# EasyEDA Pro project hexcooler_v1.epro

# Schematic Schematic1
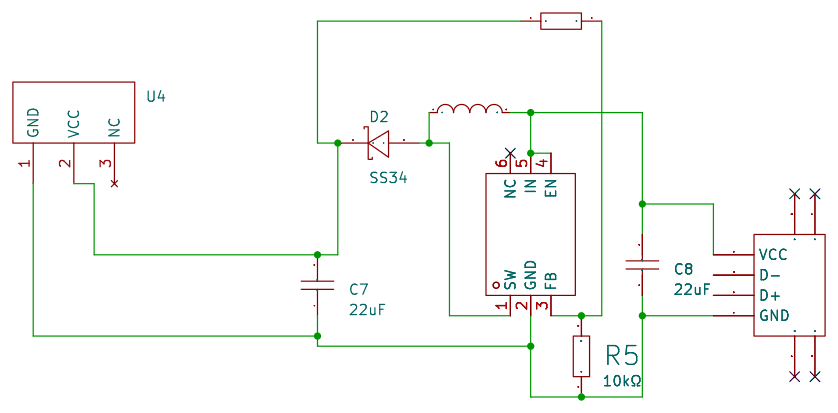
[diagram p0: schematic sheet]

## Parts
C7  22uF  [C1206]
C8  22uF  [C1206]
D2  SS34  [SMA_L4.3-W2.6-LS5.2-RD]
L1  4.7uH  [IND-SMD_L3.0-W3.0_LQH3NPN2R2NG0L]
R3  200kΩ  [R0805]
R5  10kΩ  [R0603]
U3  MT3608  [SOT-23-6_L2.9-W1.6-P0.95-LS2.8-BL]
U4  -  [pads junction]
USB6  911-321B2028S10100  [USB-A-SMD_911-321B2028S10100]

## Library data of the parts
C7 C8 = CL31A226KAHNNNE: Capacitance:22uF Tolerance:±10% Tolerance:±10% Voltage Rating:25V Temperature Coefficient:X5R; LCSC Part Name: 22uF ±10% 25V; Supplier Part: C12891; Manufacturer: SAMSUNG(三星); Supplier Footprint: 1206; JLCPCB Part Class: Basic Part; Datasheet: https://item.szlcsc.com/datasheet/CL31A226KAHNNNE/13537.html; Supplier: LCSC; Tolerance: ±10%; Voltage Rating: 25V; Temperature Coefficient: X5R
D2 = SS34_C8678: Diode Configuration:Independent Voltage - Forward(Vf@If):550mV@3A Voltage - DC Reverse(Vr):40V Current - Rectified:3A Reverse Leakage Current (Ir):500uA@40V Operating Junction Temperature Range:-55℃~+125℃ Operating Junction Temperature Range:-55℃~+125℃; LCSC Part Name: 电压:40V 电流:3A; Supplier Part: C8678; Manufacturer: MDD(辰达半导体); Supplier Footprint: SMA(DO-214AC); JLCPCB Part Class: Basic Part; Datasheet: https://item.szlcsc.com/datasheet/SS34/9178.html; Supplier: LCSC; Diode Configuration: Independent; Voltage - Forward(Vf@If): 550mV@3A; Voltage - DC Reverse(Vr): 40V; Current - Rectified: 3A; Reverse Leakage Current (Ir): 500uA@40V; Operating Junction Temperature Range: -55℃~+125℃
L1 = LQH3NPN4R7MJRL: Inductance:4.7uH Tolerance:±20% Tolerance:±20% Current Rating:- Current - Saturation (Isat):- DC Resistance(DCR):120mΩ Q @ Frequency:- Frequency - Self Resonant:40MHz Ratings:-; LCSC Part Name: 4.7uH ±20%; Supplier Part: C668452; Manufacturer: muRata(村田); Supplier Footprint: SMD,3x3mm; JLCPCB Part Class: Extended Part; Datasheet: https://item.szlcsc.com/datasheet/LQH3NPN4R7MJRL/698341.html; Supplier: LCSC; Tolerance: ±20%; DC Resistance(DCR): 120mΩ; Frequency - Self Resonant: 40MHz
R3 = 0805W8F2003T5E: Type:Thick Film Resistors Resistance:200kΩ Tolerance:±1% Tolerance:±1% Power(Watts): Overload Voltage (Max): Temperature Coefficient:±100ppm/℃ Temperature Coefficient:±100ppm/℃ Operating Temperature Range:-55℃~+155℃ Operating Temperature Range:-55℃~+155℃; LCSC Part Name: 200kΩ ±1% 125mW 厚膜电阻; Supplier Part: C17539; Manufacturer: UNI-ROYAL(厚声); Supplier Footprint: 0805; JLCPCB Part Class: Basic Part; Datasheet: https://atta.szlcsc.com/upload/public/pdf/source/20200306/C422600_1E6D84923E4A46A82E41ADD87F860B5C.pdf; Supplier: LCSC; Type: Thick Film Resistors; Tolerance: ±1%; Temperature Coefficient: ±100ppm/℃; Operating Temperature Range: -55℃~+155℃
R5 = 0603WAF1002T5E: Type:Thick Film Resistor Resistance:10kΩ Tolerance:±1% Tolerance:±1% Power(Watts):100mW Voltage-Supply(Max):75V Temperature Coefficient:±100ppm/℃ Temperature Coefficient:±100ppm/℃ Operating Temperature:-55℃~+155℃ Operating Temperature:-55℃~+155℃; LCSC Part Name: 厚膜电阻 10kΩ ±1% 100mW; Supplier Part: C25804; Manufacturer: UNI-ROYAL(厚声); Supplier Footprint: 0603; JLCPCB Part Class: Basic Part; Datasheet: https://item.szlcsc.com/datasheet/0603WAF1002T5E/26547.html; Supplier: LCSC; Type: Thick Film Resistor; Tolerance: ±1%; Power(Watts): 100mW; Voltage-Supply(Max): 75V; Temperature Coefficient: ±100ppm/℃; Operating Temperature: -55℃~+155℃
U3 = MT3608: Function:Boost Output Type:Adjustable Voltage - Supply:2V~24V Voltage - Supply:2V~24V Output Voltage:- Output Voltage:- Output Current:2A Frequency - Switching:1.2MHz Frequency - Switching:1.2MHz Operating Temperature:-40℃~+85℃ Operating Temperature:-40℃~; LCSC Part Name: 老版本 高效1.2MHz 2A升压转换器; Supplier Part: C84817; Manufacturer: 西安航天民芯; Supplier Footprint: SOT-23-6; JLCPCB Part Class: Extended Part; Datasheet: https://item.szlcsc.com/datasheet/MT3608/85988.html; Supplier: LCSC; Function: Boost; Output Type: Adjustable; Voltage - Supply: 2V~24V; Output Current: 2A; Frequency - Switching: 1.2MHz; Operating Temperature: -40℃~+85℃; Synchronous Rectifier: No; Number of Outputs: 1; Topology: Boost; Quiescent Current: 100uA；1.6mA; Switch tube (built-in/external): Built-in
U4 = connector for m y fan
USB6 = 911-321B2028S10100: Connector Type:Type-A Standard:USB 2.0 Gender:Female Number of Ports:1 Number of Contacts:4P Mounting Style:卧贴 Current Rating - Power (Max):- Operating Temperature Range:-55℃~+85℃ Operating Temperature Range:-55℃~+85℃; LCSC Part Name: Type-A 母 卧贴; Supplier Part: C42474; Manufacturer: 精拓金; Supplier Footprint: SMD; JLCPCB Part Class: Extended Part; Datasheet: https://atta.szlcsc.com/upload/public/pdf/source/20210226/C42474_500D8FED4F9B7E47FAA722F756CFCB22.pdf; Supplier: LCSC; Connector Type: Type-A; Standard: USB 2.0; Gender: Female; Number of Ports: 1; Number of Contacts: 4P; Mounting Style: 卧贴; Operating Temperature Range: -55℃~+85℃

## Nets
$1N1254: D2.2(A) L1.1 U3.1(SW)
$1N1369: R3.2 R5.2 U3.3(FB)
$1N2390: C8.2 L1.2 U3.4(EN) U3.5(IN) USB6.1(VCC)
$1N3225: C7.2 D2.1(K) R3.1 U4.2(VCC)
$1N3254: C7.1 C8.1 R5.1 U3.2(GND) U4.1(GND) USB6.4(GND)

Not connected (* = marked no-connect by the designer): U3 6(NC)*; U4 3(NC); USB6 2(D-) 3(D+) 5* 6(1)* 7(2)* 8(3)*

# Board PCB1
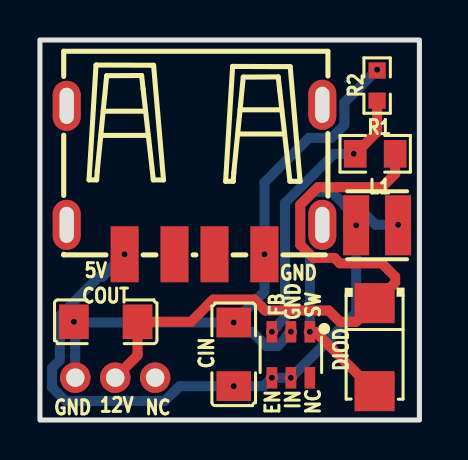
[diagram p1: board, top side]
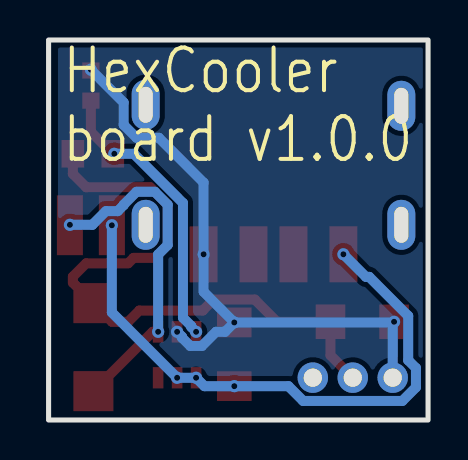
[diagram p2: board, bottom side, seen from below]

Outline 19 x 19 mm; copper layers: Top Layer, Bottom Layer. Coordinates in mm from the lower left corner of the outline.
Outline path: rectangle 0,19 19,0
Stack: Top Layer 0.035mm / Dielectric1 1.51mm FR4 er 4.5 / Bottom Layer 0.035mm

## Design rules (mm)
template: JLCPCB Capability(Two Layers Board)
spacing copperThickness1oz (default): track to track 0.102, other pairs 0.152 to 0.3
spacing copperThickness2oz: track to track 0.203, other pairs 0.152 to 0.3
track width copperThickness1oz (default): min 0.127, default 0.254, max 2.54
track width copperThickness2oz: min 0.203, default 0.254, max 2.54
differential pair differentialPair (default): width min 0.127, default 0.254, max 2.54; gap min 0.152, default 0.152
via viaSize (default): diameter min 0.5, default 0.61, max 10; hole min 0.3, default 0.305, max 6.3

## Placement (name value [footprint] x y rotation side)
C7  22uF  [C1206]  3.29 4.91 0 top
C8  22uF  [C1206]  9.7 3.28 270 top
D2  SS34  [SMA_L4.3-W2.6-LS5.2-RD]  16.76 3.64 270 top
L1  4.7uH  [IND-SMD_L3.0-W3.0_LQH3NPN2R2NG0L]  16.88 9.74 180 top
R3  200kΩ  [R0805]  16.79 13.31 180 top
R5  10kΩ  [R0603]  16.88 16.72 270 top
U3  MT3608  [SOT-23-6_L2.9-W1.6-P0.95-LS2.8-BL]  12.56 3.26 180 top
U4  -  [pads junction]  1.77 2.12 0 top
USB6  911-321B2028S10100  [USB-A-SMD_911-321B2028S10100]  7.74 12.02 180 top

## Footprints (pads in the part's own frame, mm; a bottom-side part is the same pattern mirrored in y, then rotated)
C1206
  rect 1.485x1.728 smd: 1(-1.593,0) 2(1.593,0)
IND-SMD_L3.0-W3.0_LQH3NPN2R2NG0L
  rect 1.3x3 smd: 1(-1.05,0) 2(1.05,0)
pads junction
  round 1.524 hole 0.914: 1(0,0) 2(2,0) 3(4,0)
R0603
  rect 0.806x0.864 smd: 1(-0.753,0) 2(0.753,0)
R0805
  rect 1.133x1.377 smd: 1(-1,0) 2(1,0)
SMA_L4.3-W2.6-LS5.2-RD
  rect 2x2 smd: 1(-2.2,0) 2(2.2,0)
SOT-23-6_L2.9-W1.6-P0.95-LS2.8-BL
  rect 0.532x1.072 smd: 1(-0.95,-1.149) 2(0,-1.149) 3(0.95,-1.149) 4(0.95,1.149) 5(0,1.149) 6(-0.95,1.149)
USB-A-SMD_911-321B2028S10100
  rect 1.4x2.8 smd: 1(3.5,3.737) 2(1.001,3.737) 3(-1.001,3.737) 4(-3.5,3.737)
  oval 1.4x2.5 hole 0.7x1.8: 5(-6.401,2.264) 6(-6.401,-3.737) 7(6.401,-3.687) 8(6.401,2.264)

## Nets
As in the schematic.

Pads without a net: U3 6; U4 3; USB6 2 3 5 6 7 8

## Via types
v1: diameter 0.61, hole 0.305, Top Layer to Bottom Layer, 14 vias

## Routing (per net, layer and track width the routed paths; a pad name or vN(x,y) marks a point on that pad's centre or on a via; arc(x,y) is an arc through that point)
$1N1254: length 16.9
  Top Layer w0.5: v1(13.51,4.41) 13.79,4.41 D2.2
  Bottom Layer w0.5: v1(13.51,4.41) 13.51,8.28 13.04,8.75 13.04,10.77 13.68,11.41 14.6,11.41 15.24,10.77 15.24,10.74 15.54,10.44 16.13,10.44 16.81,9.76 v1(17.93,9.76)
$1N1369: length 14.3
  Top Layer w0.5: R5.2 16.88,14.41 R3.2
  Bottom Layer w0.5: v1(15.71,13.31) 14.73,13.31 12.27,10.85 12.27,5.12 11.86,4.7 11.86,4.65 v1(11.62,4.41)
$1N2390: length 30
  Bottom Layer w0.5: v1(15.83,9.74) 15.83,5.38 v1(12.56,2.11) v1(11.62,2.11) 11.2,1.69 v1(9.7,1.69) 6.99,1.69 6.25,0.95 1.29,0.95 0.61,1.64 0.61,2.6 0.99,2.99 0.99,5.2 2.95,7.16 3.11,7.16 v1(4.24,8.29)
$1N3225: length 32
  Top Layer w0.5: R3.1 17.79,12.31 17.12,11.64 13.91,11.64 13.04,10.77 13.04,8.75 13.68,8.11 14.74,8.11 15.02,7.83 17.12,7.83 17.79,7.17 17.79,6.87 15.83,4.91 15.02,4.91 14.46,5.47 11.28,5.47 10.73,6.02 8.67,6.02 7.56,4.91 C7.2 4.89,3.23 U4.2
$1N3254: length 30.7
  Bottom Layer w0.5: v1(16.88,17.52) 15.24,15.88 15.24,14.75 14.6,14.11 13.47,14.11 11.24,11.87 v1(11.24,8.29) 11.24,6.41 v1(9.7,4.88) ; U4.1 1.77,4.84 1.74,4.88 ; v1(12.56,4.41) 12.32,4.17 12.32,4.12 11.91,3.7 11.32,3.7 10.62,4.41 10.17,4.41 v1(9.7,4.88) ; 1.74,4.88 v1(1.7,4.91) ; 1.74,4.88 v1(9.7,4.88)

## Copper pours and planes (outline as drawn; the poured copper is in the pictures)
$1N3254 on Bottom Layer: 0.25,18.63 18.53,18.63 18.53,0.47 0.25,0.47

## Text on the board
Bottom Silkscreen Layer: HexCooler / board v1.0.0
Top Silkscreen Layer: GND | COUT | 5V | 12V | NC | CIN | EN | FB | IN | SW | DIOD | R2 | R1
